# Altium project EDR_V2.PrjPcb
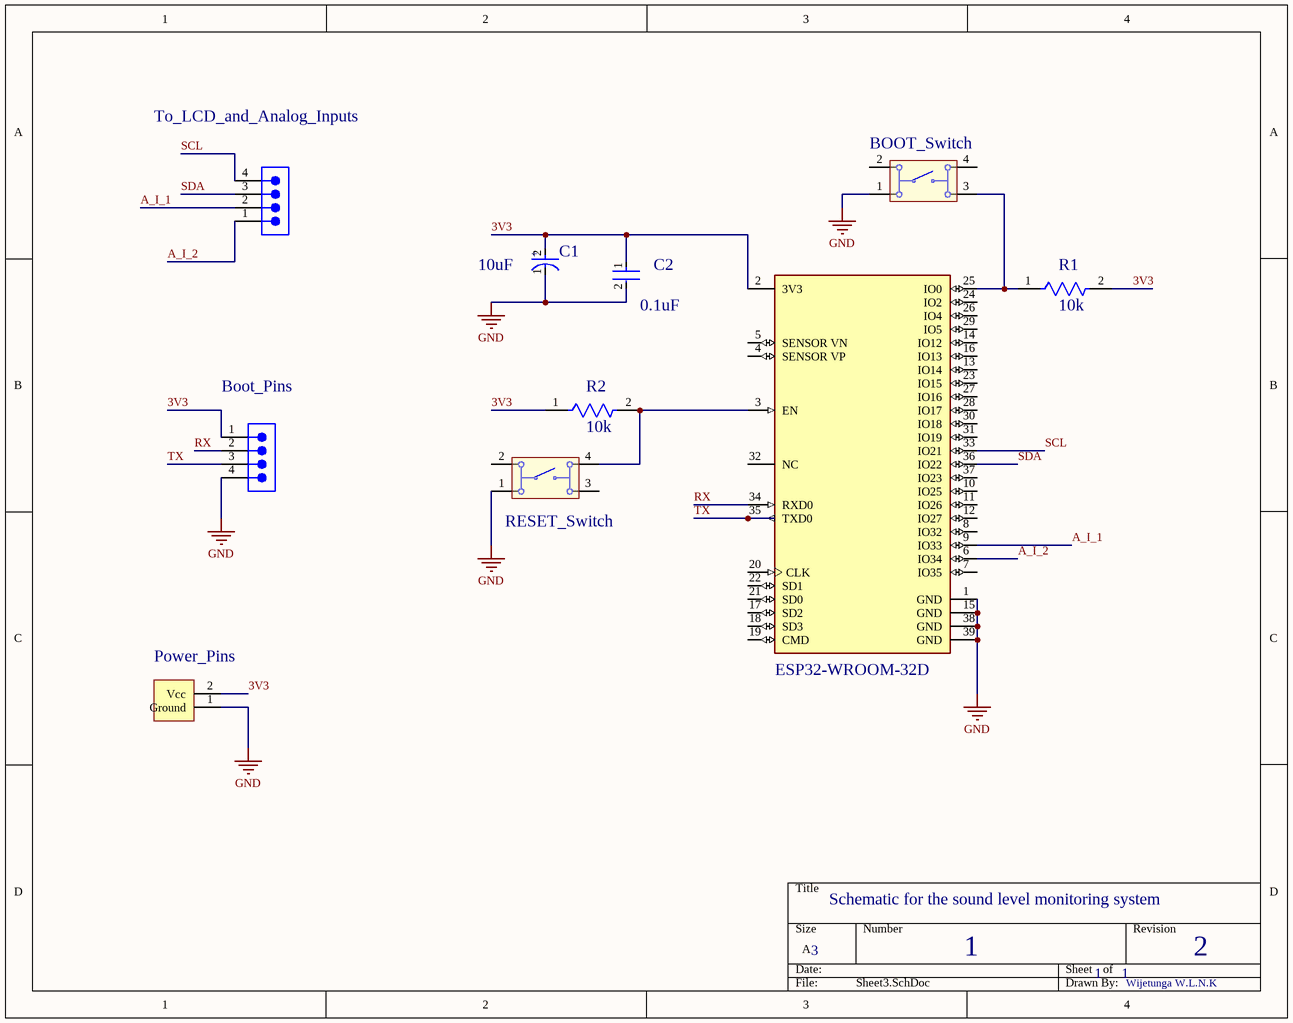
[diagram p0: Sheet3.SchDoc]
1 sheet, 10 parts. Net scope: global (net labels, ports and power ports of the same name join across sheets).
Board files: Sound_Level_Monitoring_PCB.PcbDoc, PCB2.PcbDoc

## Sheet Sheet3.SchDoc
size A; SheetNumber: 1; SheetTotal: 2

### Parts
Boot_Pins  TSW-104-08-L-S  [SMTC-TSW-104-08-X-S]  (value not drawn)
BOOT_Switch  430471025826  [430471025826]  (value not drawn)
C1  10uF  [FP-RAD-TH-D_10_0_5-L_16_1-MFG]
C2  0.1uF  [FP-RCE0DB-MFG]
ESP32-WROOM-32D  ESP32-WROOM-32D  [FP-ESP32-WROOM-32D-MFG]  (value not drawn)
Power_Pins  (no value)  [HDR1X2]
R1  10k  [FP-MBB0207-MFG]
R2  10k  [FP-MBB0207-MFG]
RESET_Switch  430471025826  [430471025826]  (value not drawn)
To_LCD_and_Analog_Inputs  TSW-104-08-L-S  [SMTC-TSW-104-08-X-S]  (value not drawn)

### Nets
GND: Boot_Pins.4 BOOT_Switch.1 C1.1(C) C2.2 ESP32-WROOM-32D.1(GND) ESP32-WROOM-32D.15(GND) ESP32-WROOM-32D.38(GND) ESP32-WROOM-32D.39(GND) Power_Pins.1(Ground) RESET_Switch.1
3V3: Boot_Pins.1 C1.2(A) C2.1 ESP32-WROOM-32D.2(3V3) Power_Pins.2(Vcc) R1.2 R2.1
A_I_1: ESP32-WROOM-32D.9(IO33) To_LCD_and_Analog_Inputs.2
A_I_2: ESP32-WROOM-32D.6(IO34) To_LCD_and_Analog_Inputs.1
RX: Boot_Pins.2 ESP32-WROOM-32D.34(RXD0)
SCL: ESP32-WROOM-32D.33(IO21) To_LCD_and_Analog_Inputs.4
SDA: ESP32-WROOM-32D.36(IO22) To_LCD_and_Analog_Inputs.3
TX: Boot_Pins.3 ESP32-WROOM-32D.35(TXD0)
NetBOOT_Switch_3: BOOT_Switch.3 ESP32-WROOM-32D.25(IO0) R1.1
NetESP32-WROOM-32D_3: ESP32-WROOM-32D.3(EN) R2.2 RESET_Switch.4

Not connected (* = marked no-connect by the designer): BOOT_Switch 2 4; ESP32-WROOM-32D 4(SENSOR_VP) 5(SENSOR_VN) 7(IO35) 8(IO32) 10(IO25) 11(IO26) 12(IO27) 13(IO14) 14(IO12) 16(IO13) 17(SD2) 18(SD3) 19(CMD) 20(CLK) 21(SD0) 22(SD1) 23(IO15) 24(IO2) 26(IO4) 27(IO16) 28(IO17) 29(IO5) 30(IO18) 31(IO19) 32(NC) 37(IO23); RESET_Switch 2 3

### Notes on the sheet
- Schematic for the sound level monitoring system
- 3
- 1
- 2
- Wijetunga W.L.N.K
- (in symbol CMP-05427-000979-1) +

### Library data of the parts
Boot_Pins To_LCD_and_Analog_Inputs = CMP-1024-00358-1: 0.025" SQ Post Header, Through-hole, Vertical, -55 to 125 degC, 2.54 mm Pitch, 4-Pin, Male, RoHS; Manufacturer: Samtec; Pitch: 2.54 mm; PartNumber: TSW-104-08-L-S; RoHS: True; Temperature Range: -55 to 125 degC; PackageDescription: .025[0.64] SQ. Post Terminal Strip Assembly; Orientation: Vertical; ComponentLink2URL: http://www.samtec.com/documents/webfiles/pdf/TSW_TH.PDF; ComponentLink1Description: Manufacturer URL; ComponentLink2Description: Datasheet; PackageVersion: DM, 8/1988; ComponentLink3URL: http://www.samtec.com/documents/webfiles/cpdf/TSW-XXX-XX-XXX-X-XX-XXX-MKT.pdf; Mounting Technology: Through-hole; PackageReference: TSW-104-08-X-S; ComponentLink3Description: Package Specification; ComponentLink1URL: http://www.samtec.com; DatasheetVersion: F-214
BOOT_Switch RESET_Switch = CMP-1452-00022-1: WS-TASV SMD Tact Switch 6X6 mm; Manufacturer: Wuerth Elektronik; NoPins: 04; ComponentLink1Description: Manufacturer URL; PackageReference: 430471025826; ComponentLink2Description: Datasheet; ComponentLink2URL: http://katalog.we-online.de/em/datasheet/4304x1.pdf; ComponentLink1URL: http://www.we-online.com; PartNumber: 430471025826
C1 = CMP-05427-000979-1: Aluminum Electrolytic Capacitors (Radial Lead Type) AEC-Q200 Qualified 1000uF ±20% 10V; Leakage Current: 3uA; Lead Diameter: 0.6mm; Ripple Current: 1.05A; ESR (Equivalent Series Resistance): 68mR; Life (Hours): 3000Hour; Capacitance: 1mF; Dielectric Material: Aluminium; Packaging: Bulk; Lead Free: Lead Free; Min Operating Temperature: -55°C; Case/Package: Radial; Mount: Through Hole; Termination: Radial; Voltage: 10V; Height: 16mm; Lead Pitch: 5mm; RoHS Compliant: Yes; Voltage Rating (DC): 10V; Length: 16mm; Package Quantity: 200; Max Operating Temperature: 105°C; Ratings: AEC-Q200; Radiation Hardening: No; Contact Plating: Tin; Size: 16mm; Height - Seated (Max): 0.63inch; Diameter: 10mm; REACH SVHC: No SVHC; Series: FC; Construction: RADIAL; Voltage Rating: 10V; Tolerance: 20%; Impedance: 68mR
C2 = CMP-06035-048089-1: Cap Ceramic 100nF 50V X7R ±10% Radial 2.5mm +125°C Ammo Pack; Lead/Base Style: Straight; Lead Diameter: 0.5mm; Height: 3.5mm; Lead Pitch: 0.098inch; Case/Package: Radial; Height - Seated (Max): 0.138inch; Dielectric: X7R; Min Operating Temperature: -55°C; Tolerance: 10%; Max Operating Temperature: 125°C; Mount: Through Hole; Package Quantity: 2000; Voltage Rating: 50V; Lead Free: Lead Free; Capacitance: 100nF; Termination: Radial; Width: 0.098inch; Resistor Type: Ceramic; Voltage Rating (DC): 50V; Ratings: AEC-Q200; Length: 0.142inch; Packaging: Tape and Reel
ESP32-WROOM-32D = CMP-194065-000003-1: WIFI MODULE 32MBITS SPI FLASH; Manufacturer: Espressif Systems; Max Supply Voltage: 3.6V; Nominal Supply Current: 500mA; Max Frequency: 2484MHz; Number Of Adc Channels: 16; Number Of Gpio: 32; Interface: I2C,SPI,UART,Ethernet,I2S,Other; Data Rate: 150Mbits/s; Min Supply Voltage: 3V; Bandwidth: 72MHz; Sensitivity: -98dBm; Octopart: https://octopart.com/esp32-wroom-32d-espressif+systems-91040050; Package: ESP32-WROOM-32D; ComponentLink2URL: https://www.espressif.com/sites/default/files/documentation/esp32-wroom-32d_esp32-wroom-32u_datasheet_en.pdf; Lead Free: Yes; Category: UNK; Mouser Description: Wi-Fi/BT BLE Module ESP32-D0WD, SPI Flash, UART, P; Device Class L1: Integrated Circuits (ICs); RoHS: TRUE; Temperature Range Low: -40°C; ComponentLink2Description: Datasheet; Digikey Description: WIFI MODULE 32MBITS SPI FLASH; Height: 3.2mm; Temperature: -40°C to +85°C; Manufacturer Part Number: ESP32-WROOM-32D; Device Class L3: Transceivers; Device Class L2: RF Semiconductors and Devices; Temperature Range High: +85°C; Automotive: No
Power_Pins = CMP-307-000070-1: Header, 2-Pin; Signal Integrity: Connector; Design Item ID: Header 2; Publisher: Altium Limited; Source: Miscellaneous Connectors.SchLib; LatestRevisionNote: Re-released for DXP Platform.; Pin Count: 2; Component Type: Standard; LatestRevisionDate: 17-Jul-2002
R1 R2 = CMP-02408-000035-1: RES 10K OHM 0.6W 1% AXIAL; Voltage Rating: 300V; Resistance: 10kR; Max Power Dissipation: 600mW; Temperature Coefficient: 50ppm/°C; Radiation Hardening: No; Case/Package: Conformal; Termination: Axial; Military Standard: Not; Length: 6.5mm; Voltage Rating (DC): 300V; RoHS Compliant: Yes; Number of Terminations: 2; Packaging: Tape and Reel; Features: Automotive AEC-Q200; Tolerance: 1%; Min Operating Temperature: -55°C; Power Rating: 600mW; Lead Free: Lead Free; Resistor Type: Metal Film; Construction: Cylindrical; Series: MBB 0207 - Professional; Max Operating Temperature: 155°C; Diameter: 2.5mm; Resistance Tolerance: 1%; Contact Plating: Tin; Technology: THIN FILM